# EAGLE design watch (EAGLE 5.11)
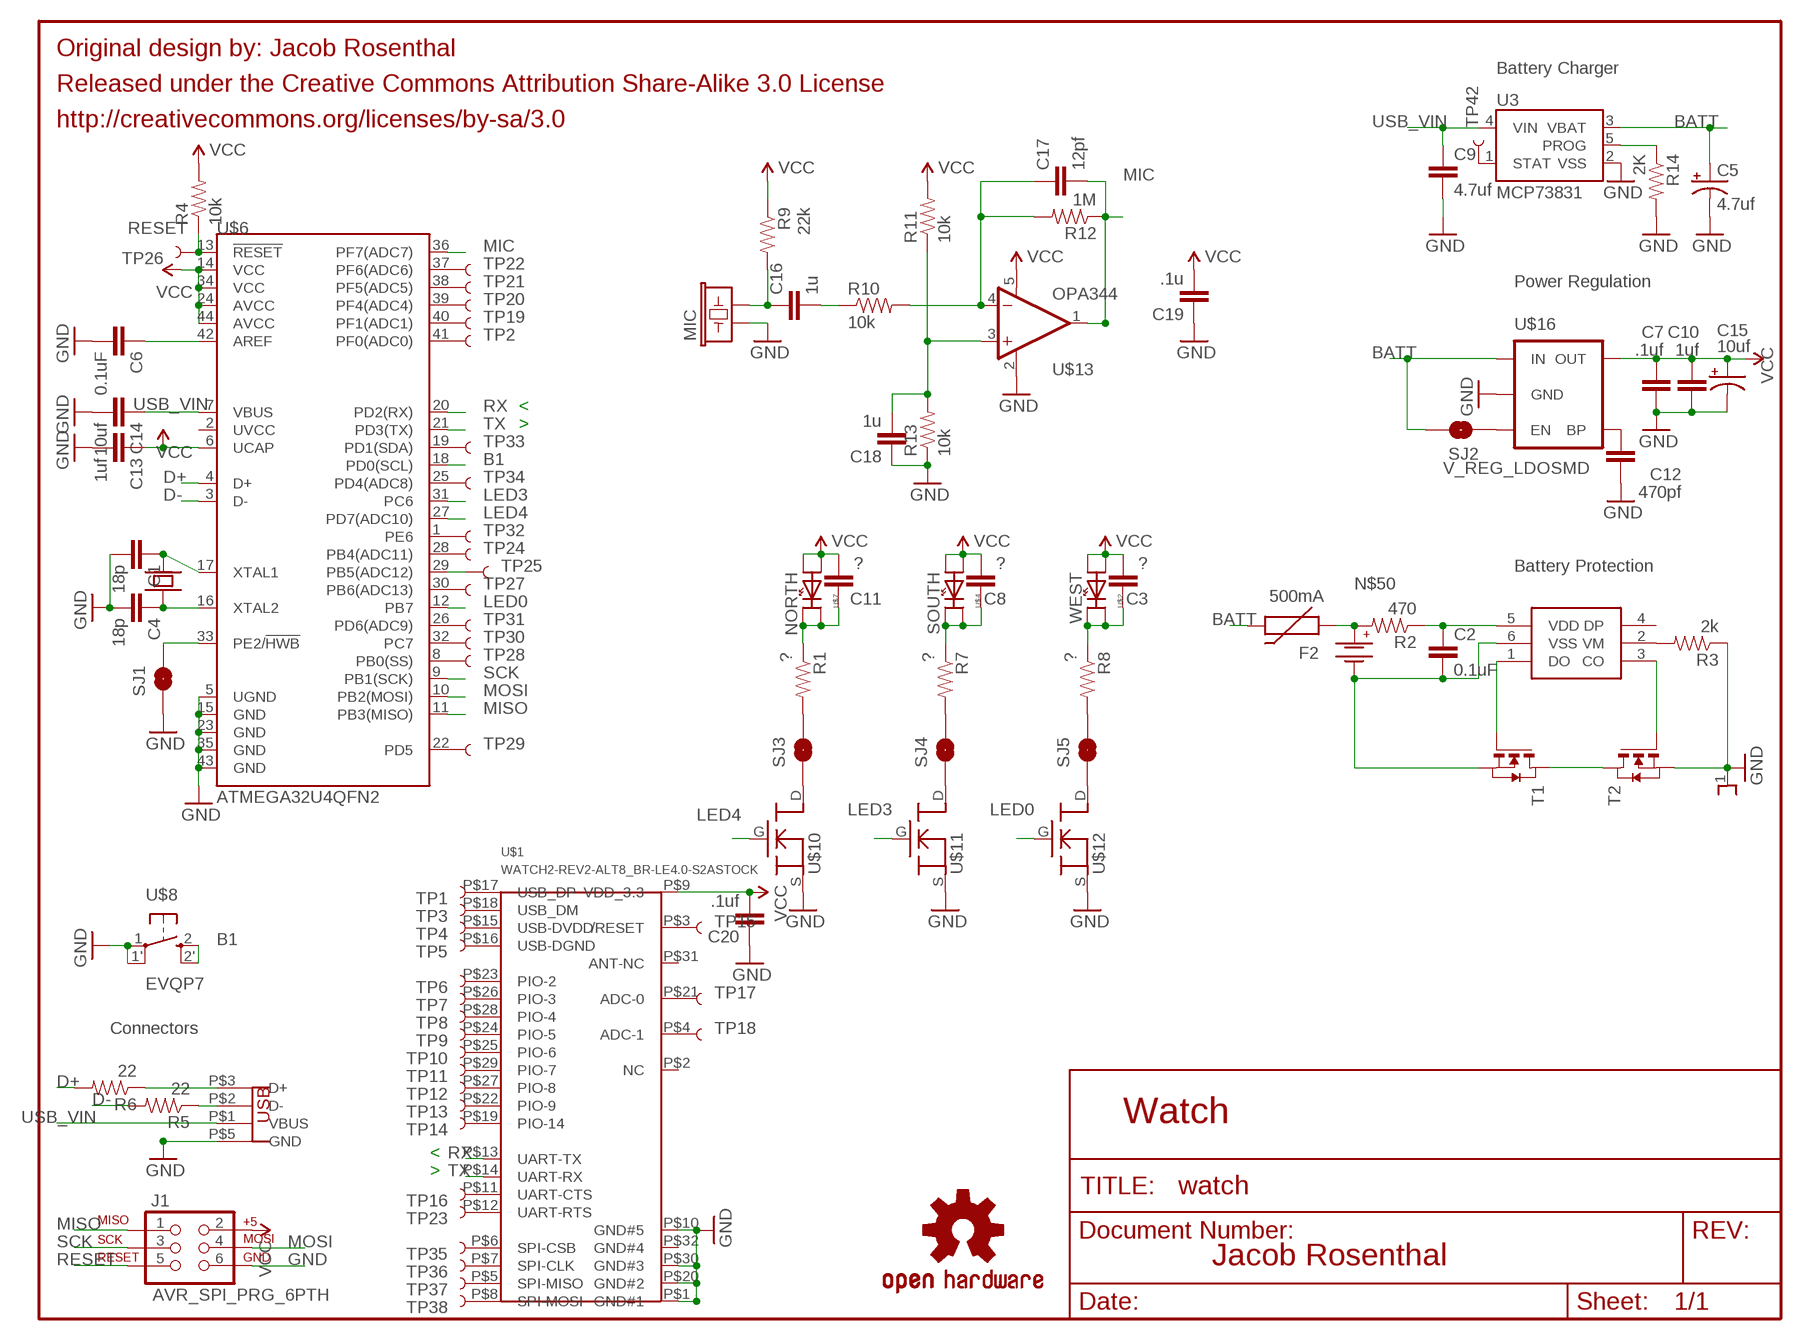
[diagram p0: schematic, sheet 1]

## Parts
C1  18p  CAP0805  [0805]
C2  0.1uF  CAP0805  [0805]
C3  ?  CAP0805  [0805]
C4  18p  CAP0805  [0805]
C5  4.7uf  CAP_POL1206  [EIA3216]
C6  0.1uF  CAP0805  [0805]
C7  .1uf  CAP0805  [0805]
C8  ?  CAP0805  [0805]
C9  4.7uf  CAP0805  [0805]
C10  1uf  CAP0805  [0805]
C11  ?  CAP0805  [0805]
C12  470pf  CAP0805  [0805]
C13  1uf  CAP0805  [0805]
C14  10uf  CAP0805  [0805]
C15  10uf  CAP_POL1206  [EIA3216]
C16  1u  CAP0805  [0805]
C17  12pf  CAP0805  [0805]
C18  1u  CAP0805  [0805]
C19  .1u  CAP0805  [0805]
C20  .1uf  CAP0805  [0805]
F2  500mA  PTCSMD  [PTC-1206]
J1  AVR_SPI_PRG_6PTH  [2X3]
MIC  SPARKFUN_MICJJROSENT_MIC_ELECTRET_SMD  [SMD_ELECTRET]
R1  ?  RESISTOR0805-RES  [0805]
R2  470  RESISTOR0805-RES  [0805]
R3  2k  RESISTOR0805-RES  [0805]
R4  10k  RESISTOR0805-RES  [0805]
R5  22  RESISTOR0805-RES  [0805]
R6  22  RESISTOR0805-RES  [0805]
R7  ?  RESISTOR0805-RES  [0805]
R8  ?  RESISTOR0805-RES  [0805]
R9  22k  RESISTOR0805-RES  [0805]
R10  10k  RESISTOR0805-RES  [0805]
R11  10k  RESISTOR0805-RES  [0805]
R12  1M  RESISTOR0805-RES  [0805]
R13  10k  RESISTOR0805-RES  [0805]
R14  2K  RESISTOR0805-RES  [0805]
SJ1  SPARKFUN_SOLDERJUMPERNC  [SPARKFUN_SJ_2S]
SJ2  SPARKFUN_SOLDERJUMPERNC  [SPARKFUN_SJ_2S]
SJ3  SPARKFUN_SOLDERJUMPERNC  [SPARKFUN_SJ_2S]
SJ4  SPARKFUN_SOLDERJUMPERNC  [SPARKFUN_SJ_2S]
SJ5  SPARKFUN_SOLDERJUMPERNC  [SPARKFUN_SJ_2S]
T1  NMOSSOT23  [SOT-23]
T2  NMOSSOT23  [SOT-23]
TP1  TEST-POINT3  [PAD.03X.03]
TP2  TEST-POINT3  [PAD.03X.03]
TP3  TEST-POINT3  [PAD.03X.03]
TP4  TEST-POINT3  [PAD.03X.03]
TP5  TEST-POINT3  [PAD.03X.03]
TP6  TEST-POINT3  [PAD.03X.03]
TP7  TEST-POINT3  [PAD.03X.03]
TP8  TEST-POINT3  [PAD.03X.03]
TP9  TEST-POINT3  [PAD.03X.03]
TP10  TEST-POINT3  [PAD.03X.03]
TP11  TEST-POINT3  [PAD.03X.03]
TP12  TEST-POINT3  [PAD.03X.03]
TP13  TEST-POINT3  [PAD.03X.03]
TP14  TEST-POINT3  [PAD.03X.03]
TP15  TEST-POINT3  [PAD.03X.03]
TP16  TEST-POINT3  [PAD.03X.03]
TP17  TEST-POINT3  [PAD.03X.03]
TP18  TEST-POINT3  [PAD.03X.03]
TP19  TEST-POINT3  [PAD.03X.03]
TP20  TEST-POINT3  [PAD.03X.03]
TP21  TEST-POINT3  [PAD.03X.03]
TP22  TEST-POINT3  [PAD.03X.03]
TP23  TEST-POINT3  [PAD.03X.03]
TP24  TEST-POINT3  [PAD.03X.03]
TP25  TEST-POINT3  [PAD.03X.03]
TP26  TEST-POINT3  [PAD.03X.03]
TP27  TEST-POINT3  [PAD.03X.03]
TP28  TEST-POINT3  [PAD.03X.03]
TP29  TEST-POINT3  [PAD.03X.03]
TP30  TEST-POINT3  [PAD.03X.03]
TP31  TEST-POINT3  [PAD.03X.03]
TP32  TEST-POINT3  [PAD.03X.03]
TP33  TEST-POINT3  [PAD.03X.03]
TP34  TEST-POINT3  [PAD.03X.03]
TP35  TEST-POINT3  [PAD.03X.03]
TP36  TEST-POINT3  [PAD.03X.03]
TP37  TEST-POINT3  [PAD.03X.03]
TP38  TEST-POINT3  [PAD.03X.03]
TP42  TEST-POINT3  [PAD.03X.03]
U3  MCP73831  [SOT23-5]
U$1  WATCH2-REV2-ALT8_BR-LE4.0-S2ASTOCK  [BR-LE4.0-X2A]
U$2  4PLLCCLED  [4-PLCC]
U$3  JJR-COINBATTERY  [JJR_COINBATTERY]
U$4  4PLLCCLED  [4-PLCC]
U$5  TP1  [TP1]
U$6  ATMEGA32U4QFN2  [QFN-44-NOPAD]
U$7  4PLLCCLED  [4-PLCC]
U$8  EVQP7  [PWB]
U$9  S8261  [SOT23-6]
U$10  NUD3105  [SOT-23(TO-236)]
U$11  NUD3105  [SOT-23(TO-236)]
U$12  NUD3105  [SOT-23(TO-236)]
U$13  OPA344  [SOT23-5]
U$14  JJR_XTAL-5X3.2  [JJR_XTAL-5X3.2]
U$15  OSHW-LOGOS  [OSHW-LOGO-S]
U$16  V_REG_LDOSMD  [SOT23-5]
X1  USBMICROB  [USB-MICROB]

## Nets
B1: U$6.18(PD0(SCL)) U$8.2 U$8.2'
BATT [VCC]: C5.A(+) F2.2 SJ2.2 U3.3(VBAT) U$16.1(IN)
CHASSISGND: C2.2 T1.2(S) U$3.- U$9.6(VSS)
D+: R6.2 U$6.4(D+)
D-: R5.2 U$6.3(D-)
GND: C1.2 C4.2 C5.C(-) C6.2 C7.1 C9.2 C10.1 C12.1 C13.2 C14.2 C15.C(-) C18.1 C19.1 C20.1 J1.6 MIC.POS R3.1 R13.1 R14.2 SJ1.1 T2.2(S) U3.2(VSS) U$1.P$1(GND#1) U$1.P$10(GND#5) U$1.P$20(GND#2) U$1.P$30(GND#3) U$5.1 U$6.5(UGND) U$6.15(GND) U$6.23(GND) U$6.35(GND) U$6.43(GND) U$8.1 U$8.1' U$10.S U$11.S U$12.S U$13.2(V-) U$16.2(GND) X1.P$5(GND)
LED0: U$6.12(PB7) U$12.G
LED1: TP27.P$1 U$6.30(PB6(ADC13))
LED2: TP25.P$1 U$6.29(PB5(ADC12))
LED3: U$6.31(PC6) U$11.G
LED4: U$6.27(PD7(ADC10)) U$10.G
MIC: C17.2 R12.1 U$6.36(PF7(ADC7)) U$13.1(OUT)
MISO: J1.1 U$6.11(PB3(MISO))
MOSI: J1.4 U$6.10(PB2(MOSI))
N$1: R3.2 U$9.2(VM)
N$2: C12.2 U$16.4(BP)
N$3: TP1.P$1 U$1.P$17(USB_DP)
N$4: C4.1 U$6.16(XTAL2) U$14.P$1
N$5: T1.3(G) U$9.1(DO)
N$6: SJ1.2 U$6.33(PE2/!HWB)
N$7: T2.3(G) U$9.3(CO)
N$9: T1.1(D) T2.1(D)
N$10: C2.1 R2.1 U$9.5(VDD)
N$11: TP2.P$1 U$6.41(PF0(ADC0))
N$12: TP19.P$1 U$6.40(PF1(ADC1))
N$13: C16.1 MIC.NEG R9.2
N$14: C17.1 R10.2 R12.2 U$13.4(-IN)
N$15: R14.1 U3.5(PROG)
N$16: C18.2 R11.1 R13.2 U$13.3(+IN)
N$17: R5.1 X1.P$2(D-)
N$18: R6.1 X1.P$3(D+)
N$19: TP20.P$1 U$6.39(PF4(ADC4))
N$20: C16.2 R10.1
N$21: TP3.P$1 U$1.P$18(USB_DM)
N$22: C6.1 U$6.42(AREF)
N$23: TP4.P$1 U$1.P$15(USB-DVDD)
N$24: TP5.P$1 U$1.P$16(USB-DGND)
N$25: TP6.P$1 U$1.P$23(PIO-2)
N$26: TP7.P$1 U$1.P$26(PIO-3)
N$27: TP8.P$1 U$1.P$28(PIO-4)
N$28: TP9.P$1 U$1.P$24(PIO-5)
N$29: TP10.P$1 U$1.P$25(PIO-6)
N$30: TP21.P$1 U$6.38(PF5(ADC5))
N$31: R1.2 SJ3.2
N$32: R7.2 SJ4.2
N$33: R8.2 SJ5.2
N$34: TP22.P$1 U$6.37(PF6(ADC6))
N$35: TP11.P$1 U$1.P$29(PIO-7)
N$36: TP24.P$1 U$6.28(PB4(ADC11))
N$37: TP12.P$1 U$1.P$27(PIO-8)
N$38: TP13.P$1 U$1.P$22(PIO-9)
N$39: TP14.P$1 U$1.P$19(PIO-14)
N$40: TP28.P$1 U$6.8(PB0(SS))
N$41: TP29.P$1 U$6.22(PD5)
N$42: TP30.P$1 U$6.32(PC7)
N$43: TP31.P$1 U$6.26(PD6(ADC9))
N$44: TP32.P$1 U$6.1(PE6)
N$45: TP33.P$1 U$6.19(PD1(SDA))
N$46: TP34.P$1 U$6.25(PD4(ADC8))
N$47: TP15.P$1 U$1.P$3(/RESET)
N$48: TP16.P$1 U$1.P$11(UART-CTS)
N$49: TP17.P$1 U$1.P$21(ADC-0)
N$50 [LEDPower]: F2.1 R2.2 U$3.+
N$51: TP18.P$1 U$1.P$4(ADC-1)
N$52: TP23.P$1 U$1.P$12(UART-RTS)
N$53: TP35.P$1 U$1.P$6(SPI-CSB)
N$54: TP36.P$1 U$1.P$7(SPI-CLK)
N$55: TP37.P$1 U$1.P$5(SPI-MISO)
N$56: TP38.P$1 U$1.P$8(SPI-MOSI)
N$57: TP42.P$1 U3.1(STAT)
N$58: SJ2.1 U$16.3(EN)
N$59: SJ3.1 U$10.D
N$60: SJ4.1 U$11.D
N$61: SJ5.1 U$12.D
N$62: C1.1 U$6.17(XTAL1) U$14.P$2
NORTH: C11.1 R1.1 U$7.A@1(A) U$7.A@2(A)
RESET: J1.5 R4.1 TP26.P$1 U$6.13(!RESET)
RX: U$1.P$13(UART-TX) U$6.20(PD2(RX))
SCK: J1.3 U$6.9(PB1(SCK))
SOUTH: C8.1 R7.1 U$4.A@1(A) U$4.A@2(A)
TX: U$1.P$14(UART-RX) U$6.21(PD3(TX))
USB_VIN [VCC]: C9.1 C14.1 U3.4(VIN) U$6.7(VBUS) X1.P$1(VBUS)
VCC [LEDPower]: C3.2 C7.2 C8.2 C10.2 C11.2 C13.1 C15.A(+) C19.2 C20.2 J1.2 R4.2 R9.1 R11.2 U$1.P$9(VDD_3.3) U$2.C@1(C) U$2.C@2(C) U$4.C@1(C) U$4.C@2(C) U$6.6(UCAP) U$6.14(VCC) U$6.24(AVCC) U$6.34(VCC) U$6.44(AVCC) U$7.C@1(C) U$7.C@2(C) U$13.5(V+) U$16.5(OUT)
WEST: C3.1 R8.1 U$2.A@1(A) U$2.A@2(A)
Unconnected: U$1.P$2(NC) U$1.P$31(ANT-NC) U$1.P$32(GND#4) U$6.2(UVCC) U$9.4(DP)

## Notes on the sheet
- Original design by: Jacob Rosenthal
- Battery Charger
- Released under the Creative Commons Attribution Share-Alike 3.0 License
- http://creativecommons.org/licenses/by-sa/3.0
- Power Regulation
- <
- >
- Battery Protection
- Connectors
- Watch
- <
- >
- Jacob Rosenthal

## Library data of the parts
C1-C4 C6-C14 C16-C20 = SparkFun:CAP: Capacitor Standard 0603 ceramic capacitor, and 0.1" leaded capacitor.
C5 C15 = SparkFun:CAP_POL: Capacitor Polarized These are standard SMD and PTH capacitors. Normally 10uF, 47uF, and 100uF in electrolytic and tantalum varieties. Always verify the external diameter of the through hole cap, it varies with capacity, voltage, and manufacturer. The EIA devices should be standard.
F2 = haptic-controller:PTC: Resettable Fuse PTC Resettable Fuse. Spark Fun Electronics SKU : COM-08357 Originally From the Sparkfun Eagle Library @ www.opencircuits.com Dated Nov 3rd 2009 CC v3.0 Share-Alike
J1 = SparkFun:AVR_SPI_PRG_6: AVR ISP 6 Pin This is the reduced ISP connector for AVR programming. Common on Arduino. This footprint will take up less PCB space and can be used with a 10-pin to 6-pin adapter such as SKU: BOB-08508
MIC = watch2-rev2-alt11:SPARKFUN_MIC: Microphone Omni-directional electret microphone. 9.7mm standard diameter.
R1-R14 = SparkFun:RESISTOR: Resistor Basic schematic elements and footprints for 0603, 1206, and PTH resistors.
SJ1-SJ5 = watch2-rev2-alt11:SPARKFUN_SOLDERJUMPER: Solder Jumper Standard SMD solder jumper. Used to automate production. Two varients : Normally Open and Normally Closed are the same, but have different paste layers. NC will have a large amount of paste and should jumper during reflow.
T1 T2 = zetex:NMOSSOT23: MOS FET; OC_FARNELL: unknown; OC_NEWARK: unknown
TP1-TP38 TP42 = SparkFun:TEST-POINT
U3 = SparkFun:MCP73831: Microchip's MCP73831 Miniature single cell, fully integrated Li-Ion, Li-polymer charge management controller http://ww1.microchip.com/downloads/en/DeviceDoc/21984a.pdf
U$1 = watch2-rev2-alt11:WATCH2-REV2-ALT8_BR-LE4.0-S2A
U$2 U$4 U$7 = jjr:4PLLCCLED: 4PLCC LED based on the Xlamp ml-b from Cree
U$3 = watch2-rev2-alt8:JJR-COINBATTERY
U$5 = watch2-rev2-alt8:TP1
U$6 = SparkFun:ATMEGA32U4
U$8 = SparkFun:EVQP7
U$9 = SparkFun:S8261: S8261 Battery Protection
U$10-U$12 = mosfet-cubic:NUD3105: NUD3105 Mosfet Integrated Relay, Inductive Load Driver
U$13 = SparkFun:OPA344
U$14 = watch2-rev2-alt11:JJR_XTAL-5X3.2
U$15 = SparkFun:OSHW-LOGO: Open Source Hardware Logo This logo indicates the piece of hardware it is found on incorporates a OSHW license and/or adheres to the definition of open source hardware found here: http://freedomdefined.org/OSHW
U$16 = SparkFun:V_REG_LDO: Voltage Regulator LDO Standard 150mA LDO voltage regulator in SOT-23 layout. Micrel part MIC5205. BP (by-pass) pin is used to lower output noise with 470pF cap.
X1 = haptic-controller:USBMICROB: Usb micro-b Designed for the CUbiC lab at Arizona State University by Jacob Rosenthal (jjrosent) 1/11/2010

## Net classes
0 Default: width 0.203 mm
1 VCC: width 0.254 mm
2 LEDPower: width 0.203 mm
3 ButtonSignal: width 0.203 mm
4 Bus: width 0.508 mm

## Board
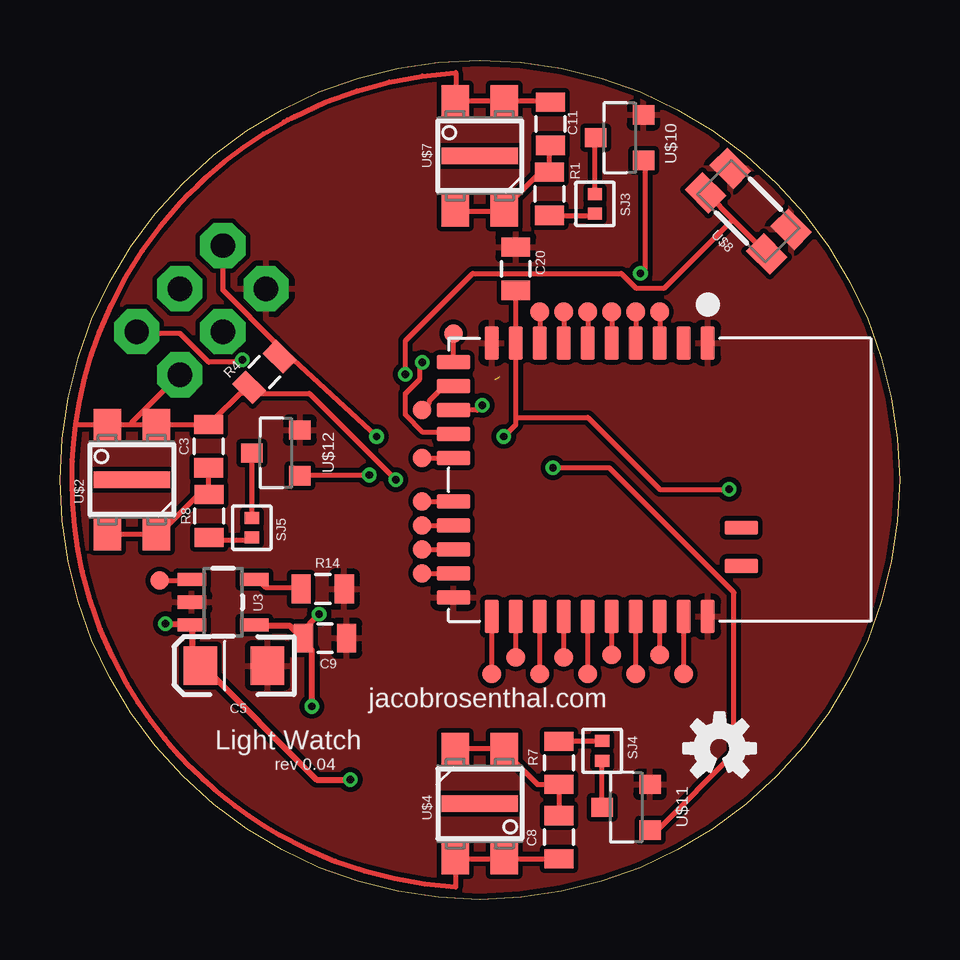
[diagram p1: board, top side]
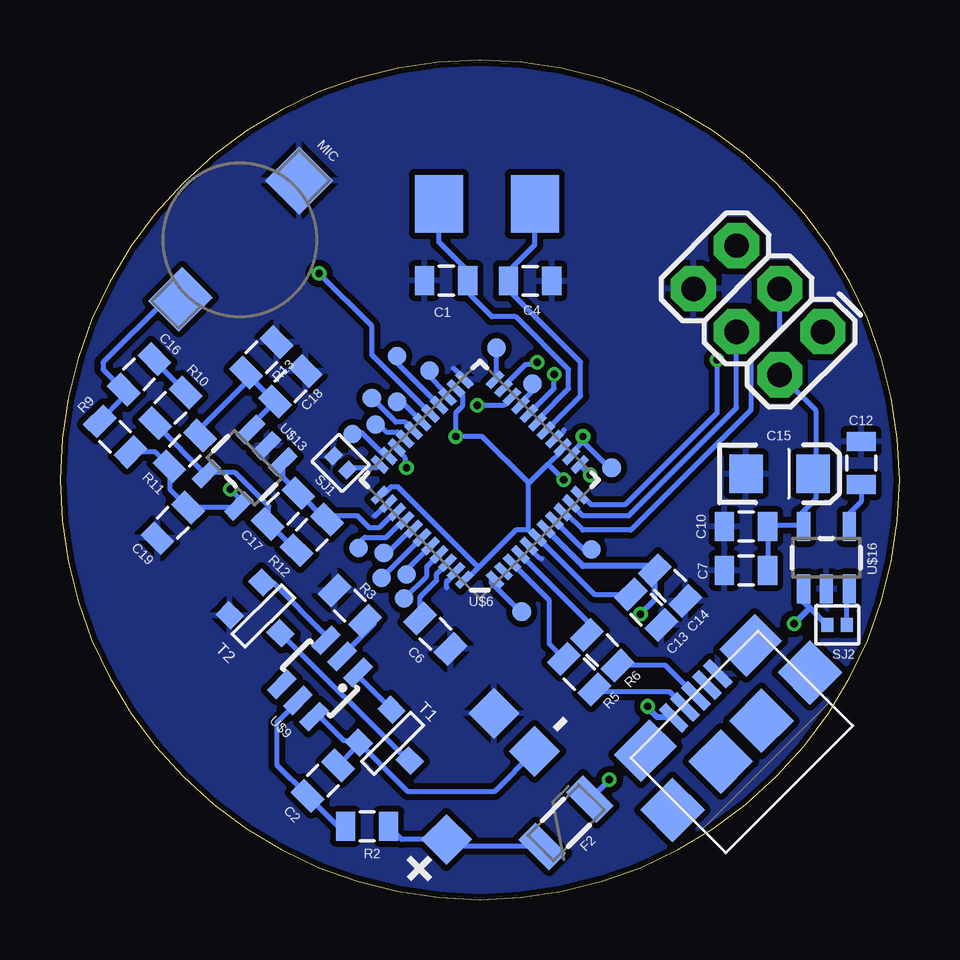
[diagram p2: board, bottom side, seen from below]

Size 35 x 35 mm. Coordinates in mm from the lower left corner, seen from the top.
Outline: 17.5,0 arc-180 17.5,35 arc-180 17.5,0
Copper layers (1*16): Top 0.035mm / dielectric 1.5mm / Bottom 0.035mm
Design rules "Fusion_eagle_rule_v1.1": minimum track width 6mil, minimum drill 12mil, track to track 6mil, track to pad 6mil, pad to pad 6mil, via to via 6mil, smd to smd 0mil, copper to edge 10mil, drill to drill 10mil, minimum pad ring 10mil, minimum via ring 6mil, stop-mask expansion 2mil, vias tented up to drill 100mil, thermal gap 10mil

### Footprints (pad centres in the part's own frame; a part is rotated, then mirrored left to right if it is on the bottom)
0805 = smd 0.8 x 1.2: 1 -0.9,0; 2 0.9,0
EIA3216 = smd 1.4 x 1.6: A 1.4,0; C -1.4,0
PTC-1206 = smd 1 x 1.8: 1 -1.4,0; 2 1.4,0
2X3 = drill 1.016 pad 1.88 octagon: 1 0,0; 2 0,2.54; 3 2.54,0; 4 2.54,2.54; 5 5.08,0; 6 5.08,2.54
SMD_ELECTRET = smd 2 x 1.8: NEG 3.5,0 | smd 2 x 2: POS -3.5,0
SPARKFUN_SJ_2S = smd 0.5 x 0.6: 1 -0.412,0; 2 0.412,0
SOT-23 = smd 0.787 x 0.889: 1 0.025,-1.016; 2 -0.94,1.016; 3 0.991,1.016
PAD.03X.03 = smd 0.762 x 0.762: P$1 0,0
SOT23-5 = smd 0.55 x 1.2: 1 -0.95,-1.3; 2 0,-1.3; 3 0.95,-1.3; 4 0.95,1.3; 5 -0.95,1.3
BR-LE4.0-X2A = smd 0.6 x 1.4: P$1 -2,-5.7; P$2 -1,-5.7; P$3 0,-5.7; P$4 1,-5.7; P$5 2,-5.7; P$6 3,-5.7; P$7 4,-5.7; P$8 5,-5.7; P$9 6,-5.7; P$10 7,-5.7; P$21 7,5.7; P$22 6,5.7; P$23 5,5.7; P$24 4,5.7; P$25 3,5.7; P$26 2,5.7; P$27 1,5.7; P$28 0,5.7; P$29 -1,5.7; P$30 -2,5.7 | smd 1.4 x 0.6: P$11 8.6,-4.9; P$12 8.6,-3.9; P$13 8.6,-2.9; P$14 8.6,-1.9; P$15 8.6,-0.9; P$16 8.6,0.9; P$17 8.6,1.9; P$18 8.6,2.9; P$19 8.6,3.9; P$20 8.6,4.9; P$31 -3.4,3.6; P$32 -3.4,2
4-PLCC = smd 1.31 x 1.15: A@1 -2.3,1.025; A@2 -2.3,-1.025; C@1 2.3,1.025; C@2 2.3,-1.025 | smd 0.7 x 3.2: P$1 0,0
JJR_COINBATTERY = smd 1.5 x 1.5: + -2.6,0; - 2.6,0
TP1 = smd 1.5 x 1.5: 1 0,0
QFN-44-NOPAD = smd 0.8 x 0.3: 1 -3.4,2.5; 2 -3.4,2; 3 -3.4,1.5; 4 -3.4,1; 5 -3.4,0.5; 6 -3.4,0; 7 -3.4,-0.5; 8 -3.4,-1; 9 -3.4,-1.5; 10 -3.4,-2; 11 -3.4,-2.5; 23 3.4,-2.5; 24 3.4,-2; 25 3.4,-1.5; 26 3.4,-1; 27 3.4,-0.5; 28 3.4,0; 29 3.4,0.5; 30 3.4,1; 31 3.4,1.5; 32 3.4,2; 33 3.4,2.5 | smd 0.3 x 0.8: 12 -2.5,-3.4; 13 -2,-3.4; 14 -1.5,-3.4; 15 -1,-3.4; 16 -0.5,-3.4; 17 0,-3.4; 18 0.5,-3.4; 19 1,-3.4; 20 1.5,-3.4; 21 2,-3.4; 22 2.5,-3.4; 34 2.5,3.4; 35 2,3.4; 36 1.5,3.4; 37 1,3.4; 38 0.5,3.4; 39 0,3.4; 40 -0.5,3.4; 41 -1,3.4; 42 -1.5,3.4; 43 -2,3.4; 44 -2.5,3.4
PWB = smd 1.4 x 1.05: 1 -1.8,0.725; 1' 1.8,0.725; 2 -1.8,-0.725; 2' 1.8,-0.725
SOT23-6@1 = smd 0.55 x 1.2: 1 0.95,1.3; 2 0,1.3; 3 -0.95,1.3; 4 -0.95,-1.3; 5 0,-1.3; 6 0.95,-1.3
SOT-23(TO-236) = smd 0.8 x 0.9: D 0,-1; G 0.95,1; S -0.95,1
JJR_XTAL-5X3.2 = smd 2 x 2.4: P$1 -2,0; P$2 2,0
USB-MICROB = smd 0.4 x 1.35: P$1 -1.3,2.675; P$2 -0.65,2.675; P$3 0,2.675; P$4 0.65,2.675; P$5 1.3,2.675 | smd 2.1 x 1.6: P$6 -3.1,2.55; P$7 3.1,2.55 | smd 1.9 x 1.9: P$8 -4.05,0; P$9 -1.2,0; P$10 1.2,0; P$11 4.05,0

### Placement (x,y rotation side)
C1  18.9,25.8 180 bottom
C2  24.04,4.96 45 bottom
C3  6.2,18.9 90 top
C4  15.4,25.79 0 bottom
C5  7.25,9.75 180 top
C6  19.35,11.08 315 bottom
C7  6.4,13.72 0 bottom
C8  20.8,2.6 270 top
C9  11.05,10.9 0 top
C10  6.4,15.55 0 bottom
C11  20.45,32.34 90 top
C12  1.6,18.2 270 bottom
C13  10.56,12.09 315 bottom
C14  9.57,13.09 315 bottom
C15  5,17.75 0 bottom
C16  31.7,21.9 45 bottom
C17  25.7,16.3 45 bottom
C18  25.4,21.4 225 bottom
C19  30.3,15.7 45 bottom
C20  19,26.3 270 top
F2  13.9,3.2 45 bottom
J1  3.2,23.67 135 bottom
MIC  27.5,27.5 225 bottom
R1  20.4,29.42 270 top
R2  22.2,3.05 0 bottom
R3  22.92,12.25 315 bottom
R4  8.52,21.99 225 top
R5  13.35,9.4 135 bottom
R6  12.39,10.39 135 bottom
R7  20.8,5.7 90 top
R8  6.22,15.99 270 top
R9  32.7,19.3 135 bottom
R10  30.4,20.5 225 bottom
R11  29.8,18.7 225 bottom
R12  24.5,15.2 225 bottom
R13  26.6,22.6 225 bottom
R14  10.95,12.95 0 top
SJ1  23.3,18.2 315 bottom
SJ2  2.6,11.45 180 bottom
SJ3  22.3,29 270 top
SJ4  22.6,6.2 90 top
SJ5  8,15.5 270 top
T1  21.16,6.49 45 bottom
T2  26.54,11.8 45 bottom
TP1  15.1,15.6 0 top
TP2  20.65,12.55 90 bottom
TP3  15.1,14.6 0 top
TP4  15.1,18.4 0 top
TP5  15.1,16.6 0 top
TP6  20,9.4 0 top
TP7  23,10.2 0 top
TP8  25,10.2 0 top
TP9  21,10.1 0 top
TP10  22,9.4 0 top
TP11  26,9.4 0 top
TP12  24,9.4 0 top
TP13  19,10.1 0 top
TP14  15.1,13.6 0 top
TP15  25,24.5 0 top
TP16  16.4,23.6 0 top
TP17  18,9.4 0 top
TP18  24,24.5 0 top
TP19  20.55,13.55 90 bottom
TP20  21.6,13.4 90 bottom
TP21  21.5,14.45 90 bottom
TP22  22.55,14.65 90 bottom
TP23  15.1,20.4 0 top
TP24  20.95,20.75 90 bottom
TP25  22,20.9 0 bottom
TP26  12,18 0 bottom
TP27  21.85,19.8 90 bottom
TP28  12.85,14.6 90 bottom
TP29  16.8,23 90 bottom
TP30  22.8,19.4 90 bottom
TP31  20.95,22.65 90 bottom
TP32  15.75,12 90 bottom
TP33  15.3,21.5 90 bottom
TP34  19.6,22.05 90 bottom
TP35  22,24.5 0 top
TP36  21,24.5 0 top
TP37  23,24.5 0 top
TP38  20,24.5 0 top
TP42  4.15,13.3 90 top
U3  6.8,12.4 270 top
U$1  25,17.5 180 top
U$2  3,17.5 90 top
U$3  17.05,4.34 45 bottom
U$4  17.5,4 270 top
U$5  16.91,7.76 45 bottom
U$6  17.5,17.5 135 bottom
U$7  17.5,31 90 top
U$8  28.7,28.7 315 top
U$9  S8261  [SOT23-6@1]  24.16,9.22 315 bottom
U$10  23.33,31.76 270 top
U$11  23.6,3.85 270 top
U$12  9,18.62 270 top
U$13  27.3,18 135 bottom
U$14  17.2,29 180 bottom
U$15  27.5,6.3 0 top
U$16  3.05,14.25 0 bottom
X1  6.6,6.6 45 bottom

### Tracks (layer width: path | path; a pad name or v marks a point on that pad's centre or on a via)
B1  (via drill 0.3)
  Top 0.203: 28.05,28.35 29.4,27 U$8.2' | 28.05,28.35 27,29.4 U$8.2 | v14.4,21.9 14.4,23.3 17.2,26.1 23.4,26.1 24,25.5 25.2,25.5 28.05,28.35
  Bottom 0.203: U$6.18 14.4,21.31 v14.4,21.9
BATT  (via drill 0.3)
  Top 0.254: v4.4,11.5 5.4,11.5 U3.3 5.5,11.4 5.5,10.1 C5.A 5.9,9.8 10.7,5 v12.1,5
  Bottom 0.254: 3.75,12.15 4,12.4 U$16.1 | 3.75,12.15 3.1,11.5 SJ2.2 | 3.75,12.15 v4.4,11.5 | v12.1,5 F2.2
CHASSISGND
  Bottom 0.203: T1.2 22.65,6.37 23.42,5.6 C2.2 23.3,5.6 | U$9.6 24.18,7.64 23.16,6.62 22.65,6.62 T1.2 | T1.2 20.5,4.5 16.89,4.5 U$3.-
D+
  Bottom 0.203: U$6.4 12.88,11.46 R6.2
D-
  Bottom 0.203: U$6.3 14.6,12.48 14.6,10.65 R5.2
GND  (1 unrouted)
  Bottom 0.203: U$6.15 14.22,19.3 13.97,19.56 14,19.59 | 14.91,14.21 14.99,14.22 15.49,14.73 U$6.5 | U$6.35 21.34,16.51 21.84,16 21.9,16 | U$6.43 18.5,13.6 18.8,13.3 18.88,13.29 18.9,13.2 18.9,13.1 18.88,13 | 18.35,21.8 18.35,21.9 18.6,22.15
  pour Top (isolate 0.2): 0,35 0,0 35,0 35,35
  pour Bottom (isolate 0.254, rank 3): 0,35 35,35 35,0 0,0
LED0  (via drill 0.3)
  Top 0.203: 10,17.6 U$12.G 10.1,17.7 v12.9,17.7
  Bottom 0.203: v12.9,17.7 13.3,18.1 U$6.12
LED1
  Bottom 0.203: U$6.30 20.91,19.5 21.4,19.5 21.7,19.8 TP27.P$1
LED2
  Bottom 0.203: TP25.P$1 21,19.9 20.61,19.9 U$6.29
LED3  (via drill 0.3)
  Top 0.203: 24.8,3.2 24.6,3.2 U$11.G 24.7,3 25,3 28.1,6.1 28.1,12.8 22.9,18 v20.55,18
  Bottom 0.203: 20.9,18.8 U$6.31 20.9,18.7 20.6,18.4 20.6,18 v20.55,18
LED4  (via drill 0.3)
  Top 0.203: 24.4,30.8 U$10.G 24.4,30.7 24.4,26.3 v24.2,26.1
  Bottom 0.203: U$6.27 22,22.71 22,23.9 v24.2,26.1
MIC
  Bottom 0.203: 21,16.1 U$6.36 21.1,16.1 21.7,15.5 22.1,15.5 22.6,16 23.7,16 R12.1 23.9,15.8 25,16.9 C17.2 25.1,17 25.7,17.6 25.7,18.2 U$13.1
MISO  (via drill 0.3)
  Top 0.203: v7.6,22.5 7.5,22.4 6.2,22.4 5,23.6 3.2,23.6 J1.1
  Bottom 0.203: v7.6,22.5 7.6,20.3 11.45,16.45 12.85,16.45 13.3,16.9 13.33,16.87 U$6.11
MOSI
  Bottom 0.203: U$6.10 13.7,16.5 13.2,16 11.3,16 6.8,20.5 6.8,23.6 J1.4
N$1
  Bottom 0.203: R3.2 21.9,11.5 23.2,10.2 U$9.2
N$2
  Bottom 0.203: C12.2 1.6,16.6 2.1,16.1 U$16.4
N$3
  Top 0.203: TP1.P$1 U$1.P$17
N$4
  Bottom 0.203: U$6.16 14.7,19.6 13.3,21 13.3,22.4 16.3,25.4 C4.1 16.2,25.8 16.2,26.3 15.2,27.3 U$14.P$1
N$5
  Bottom 0.203: T1.3 21.38,8.14 22.65,9.41 U$9.1
N$6
  Bottom 0.203: SJ1.2 23,18 21.8,18 21.7,18.1 U$6.33
N$7
  Bottom 0.203: T2.3 26.5,13.2 26.1,13.2 23.9,11 23.9,10.9 U$9.3
N$9
  Bottom 0.203: T1.1 20.5,5.8 T2.1
N$10
  Bottom 0.203: U$9.5 25.19,8.14 25.96,7.38 25.96,5.6 24.69,4.33 C2.1 23.4,3.05 R2.1
N$11
  Bottom 0.203: U$6.41 19.7,13.89 19.7,13.5 TP2.P$1
N$12
  Bottom 0.203: TP19.P$1 20.55,13.74 U$6.40
N$13
  Bottom 0.203: R9.2 33.3,20 32.4,20.9 32.4,21.2 C16.1 32.4,21.3 33.2,22.1 33.2,22.4 30.6,25 30,25 MIC.NEG
N$14
  Bottom 0.203: R12.2 25.2,14.6 26.3,15.7 C17.1 26.3,15.8 26.3,16.4 27.7,17.8 28.8,17.8 U$13.4 28.9,17.7 31,19.8 R10.2
N$15
  Top 0.203: R14.1 10,13 8.6,13 8.2,13.4 U3.5
N$16
  Bottom 0.203: U$13.3 27,19.6 27,19.8 C18.2 26.1,20.8 27.2,21.9 R13.2 27.1,21.7 29.1,19.7 29.1,19.4 R11.1
N$17
  Bottom 0.203: X1.P$2 9.57,8.65 12.6,8.65 R5.1
N$18
  Bottom 0.203: X1.P$3 9.75,9.75 R6.1
N$19
  Bottom 0.203: U$6.39 TP20.P$1
N$20
  Bottom 0.203: R10.1 29.8,21.2 31.1,22.5 C16.2
N$21
  Top 0.203: TP3.P$1 U$1.P$18
N$22
  Bottom 0.203: U$6.42 19.3,13.58 19.3,13.3 19.98,12.62 C6.1
N$23
  Top 0.203: TP4.P$1 U$1.P$15
N$24
  Top 0.203: TP5.P$1 U$1.P$16
N$25
  Top 0.203: TP6.P$1 U$1.P$23
N$26
  Top 0.203: TP7.P$1 U$1.P$26
N$27
  Top 0.203: TP8.P$1 U$1.P$28
N$28
  Top 0.203: TP9.P$1 U$1.P$24
N$29
  Top 0.203: TP10.P$1 U$1.P$25
N$30
  Bottom 0.203: 20.26,15.39 U$6.38 20.35,15.45 21.35,14.45 TP21.P$1
N$31
  Top 0.203: SJ3.2 22.3,28.5 20.4,28.5 R1.2
N$32
  Top 0.203: SJ4.2 22.59,6.6 R7.2
N$33
  Top 0.203: SJ5.2 8,15 6.3,15 R8.2
N$34
  Bottom 0.203: U$6.37 20.7,15.8 21.4,15.1 22.3,15.1 22.55,14.85 TP22.P$1
N$35
  Top 0.203: TP11.P$1 U$1.P$29
N$36
  Bottom 0.203: TP24.P$1 20.6,20.6 U$6.28
N$37
  Top 0.203: TP12.P$1 U$1.P$27
N$38
  Top 0.203: TP13.P$1 U$1.P$22
N$39
  Top 0.203: TP14.P$1 U$1.P$19
N$40
  Bottom 0.203: U$6.8 13.19,14.6 TP28.P$1
N$41
  Bottom 0.203: TP29.P$1 16.8,21.7 U$6.22
N$42
  Bottom 0.203: TP30.P$1 22.4,19.45 21.49,18.54 U$6.32
N$43
  Bottom 0.203: U$6.26 21.05,22.46 TP31.P$1
N$44
  Bottom 0.203: TP32.P$1 16,12.19 17.02,13.21 17.02,13.46 U$6.1
N$45
  Bottom 0.203: TP33.P$1 15.3,21.2 15.8,20.7 U$6.19
N$46
  Bottom 0.203: TP34.P$1 19.7,21.9 18.9,21.1 18.9,21 U$6.25
N$47
  Top 0.203: TP15.P$1 U$1.P$3
N$48
  Top 0.203: U$1.P$11 TP16.P$1
N$49
  Top 0.203: TP17.P$1 U$1.P$21
N$50
  Bottom 0.203: F2.1 18.6,2.21 U$3.+ 20.75,2.5 R2.2
N$51
  Top 0.203: TP18.P$1 U$1.P$4
N$52
  Top 0.203: TP23.P$1 15.4,20.7 15.4,20.8 16,21.4 U$1.P$12
N$53
  Top 0.203: TP35.P$1 U$1.P$6
N$54
  Top 0.203: TP36.P$1 U$1.P$7
N$55
  Top 0.203: TP37.P$1 U$1.P$5
N$56
  Top 0.203: TP38.P$1 U$1.P$8
N$57
  Top 0.203: TP42.P$1 5.4,13.3 U3.1
N$58
  Bottom 0.203: U$16.3 2.19,12.86 SJ2.1
N$59
  Top 0.203: SJ3.1 22.3,31.7 U$10.D
N$60
  Top 0.203: U$11.D SJ4.1
N$61
  Top 0.203: SJ5.1 U$12.D
N$62
  Bottom 0.203: U$6.17 15,20 15,20.1 13.8,21.3 13.8,22.1 16,24.3 17,24.3 18,25.3 C1.1 18,26.2 19.2,27.4 U$14.P$2
NORTH
  Top 0.203: U$7.A@1 U$7.A@2 18.5,28.8 20,30.3 20.3,30.3 R1.1 20.4,31.4 C11.1
RESET  (via drill 0.3)
  Top 0.203: R4.1 9.2,22.6 | J1.5 6.8,27.2 6.8,25.4 9.1,23.1 9.1,22.7 R4.1 | v13.2,19.3 9.2,23 R4.1
  Bottom 0.203: 13.6,18.6 13.6,18.5 13.61,18.49 U$6.13 13.6,18.7 13.2,19.1 | 12,18.1 TP26.P$1 12.1,18.1 12.2,18.1 13.2,19.1 | 13.2,19.1 v13.2,19.3
RX  (via drill 0.3)
  Top 0.203: v17.6,20.6 17.4,20.4 U$1.P$13
  Bottom 0.203: v17.6,20.6 16.5,20.6 16.2,20.9 U$6.20
SCK
  Bottom 0.203: U$6.9 14,16.1 13.9,16.1 13.2,15.4 11.2,15.4 6.2,20.4 6.2,22.5 5,23.7 5,25.4 J1.3
SOUTH
  Top 0.203: U$4.A@2 U$4.A@1 18.5,6.2 19.9,4.8 R7.1 C8.1
TX  (via drill 0.3)
  Top 0.203: U$1.P$14 16,19.4 | 15.9,19.5 15.9,19.4 U$1.P$14 | v15.1,22.4 15,22.3 15,21.7 14.4,21.1 14.4,20.2 15.1,19.5 15.8,19.5 U$1.P$14
  Bottom 0.203: U$6.21 16.5,21.4 15.6,22.3 15.2,22.3 15.2,22.4 v15.1,22.4
USB_VIN  (via drill 0.3)
  Top 0.254: U3.4 8.2,11.4 9.6,11.4 10.1,10.9 C9.1 | v10.5,8.05 10.5,10.4 10.1,10.8 C9.1 | v10.8,11.9 10,11.1 C9.1
  Bottom 0.254: U$6.7 14.7,15.4 13.2,13.9 10.4,13.9 10.3,13.8 C14.1 10.2,13.6 10.2,12.5 v10.8,11.9 | 9.5,7.6 X1.P$1 9.6,7.6 10.1,7.6 10.5,8 v10.5,8.05
VCC  (via drill 0.3)
  Top 0.203: 3,19.8 U$2.C@1 0.7,19.8 0.66,19.81 | 3,19.8 U$2.C@2 4.06,19.81 6.1,19.81 C3.2 7.75,21.35 R4.2 | 2.78,8.99 arc9 4.33,6.75 arc1 4.52,6.52 arc7 5.94,5.04 arc0 6.04,4.94 arc5 7.3,3.9 arc7 9.14,2.7 arc26 16.5,0.53 16.5,0.6 16.5,1.7 U$4.C@2 U$4.C@1 C8.2 | 2.78,8.99 arc-17 0.93,13.69 arc-13 0.5,17.5 arc-8 0.66,19.81 | 0.66,19.81 arc-13 1.64,23.62 arc-22 5.04,29.06 arc-5 6.09,30.11 | 6.09,30.11 arc-13 9.34,32.41 arc-2 9.78,32.65 arc-24 16.5,34.47 16.5,34.4 16.5,33.3 U$7.C@1 U$7.C@2 20.4,33.3 C11.2 20.3,33.4 | 6.09,30.11 6.1,30.1 | J1.2 4.9,21.8 3,19.9 3,19.8 | C20.2 U$1.P$9 19,20.1 | R4.2 7.6,21.1 | 2.78,8.99 2.8,9 | R4.2 7.7,21.1 10.4,21.1 v14,17.5 | v18.5,19.3 19,19.8 19,20.1 | v27.9,17.1 25,17.1 22,20.1 19,20.1
  Bottom 0.203: 14.1,18.8 U$6.14 14.1,18.7 14.65,18.15 | U$6.44 18.1,13.4 | 18.4,21.3 U$6.24 18.4,21.2 18.2,21 18.2,20.6 18.5,20.3 v18.5,19.3 17.4,19.3 15.5,17.4 | 21.6,16.9 U$6.34 21.5,16.9 21.2,17.2 20.9,17.2 17.55,13.85 | U$6.6 | 17.55,13.85 16,15.4 15.5,15.4 | 17.55,13.85 18,13.4 U$6.44 | U$6.6 | 14.65,18.15 15.4,17.4 15.5,17.4 | v14,17.5 14.65,18.15 | v27.9,17.1 27.6,16.8 27.6,16.5 U$13.5 27.62,16.34 C19.2 30.4,17.07 30.4,18 R11.2 31.04,18.66 R9.1 | U$6.44 18.2,13.3 | 15.5,15.4 15.2,15.1 U$6.6 | 15.5,17.4 15.5,15.4 | U$6.6 12.73,12.73 C13.1 | C7.2 C10.2 5.5,15.6 4,15.6 U$16.5 4.1,15.7 4.1,16.1 3.5,16.7 3.5,17.7 C15.A 3.5,17.8 3.5,20.4 4.9,21.8 J1.2
WEST
  Top 0.203: U$2.A@1 2.03,15.24 3.81,15.24 U$2.A@2 4.1,15.2 5.8,16.9 6.1,16.9 R8.1 6.2,16.9 C3.1

### Text on the board
tPlace: jacobrosenthal.com | Light Watch | rev 0.04
bPlace: - | +